# Altium project XL6012_power.PrjPcb
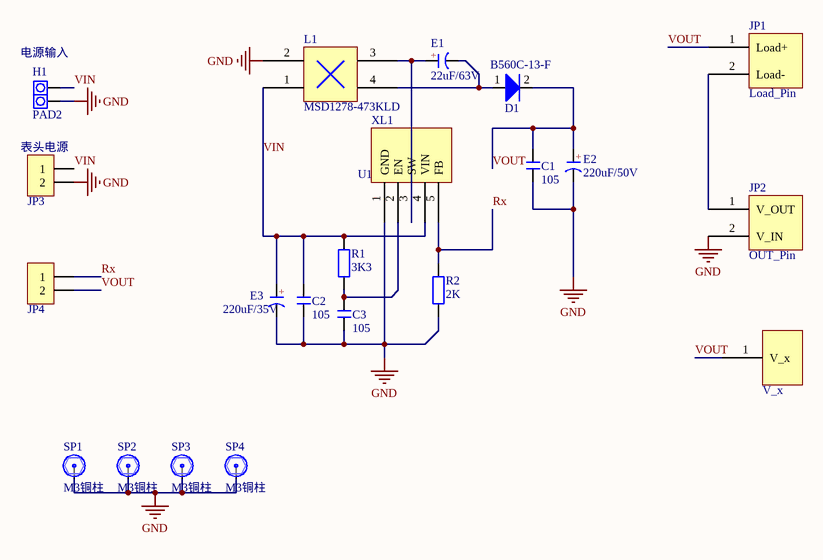
[diagram p0: BUCK-BOOST.SchDoc]
2 sheets, 41 parts. Net scope: global (net labels, ports and power ports of the same name join across sheets).
Board files: BUCK-BOOST.PcbDoc, Boost.PcbDoc
Sheets:
  BUCK-BOOST.SchDoc
  Boost.SchDoc

## Sheet BUCK-BOOST.SchDoc
size A4; SheetNumber: 1; SheetTotal: 1

### Parts
(Parts that share a designator on the sheet are numbered #1, #2 ... from top to bottom, then left to right.)
*1  V_x  [PCBComponent_1 - duplicate]
C1#1  105  [C 0603_L]
C2  105  [C 0603_L]
C3#1  105  [C 0603_L]
D1#1  B560C-13-F  [DO-214AB]
E1#1  22uF/63V  [CAP 2.5*6.3*11.2]
E2#1  220uF/50V  [CAPAER_D100_L130_P055]
E3  220uF/35V  [CAPAER_D080_L125_P035]
H1  PAD2  [PAD2-5.08]
JP1#1  Load_Pin  [connect]
JP2#1  OUT_Pin  [connect]
JP3#1  HDR-1X2  [HDR2.54-LI-2P]  (value not drawn)
JP4#1  HDR-1X2  [HDR2.54-LI-2P]  (value not drawn)
L1#1  MSD1278-473KLD  [MSD-1278]
R1#1  3K3  [R 0603_L]
R2  2K  [R 0603_L]
SP1#1  M3铜柱  [M3x4+6_L]
SP2#1  M3铜柱  [M3x4+6_L]
SP3#1  M3铜柱  [M3x4+6_L]
SP4#1  M3铜柱  [M3x4+6_L]
XL1  U1  [T220-5]

### Nets
GND: C1#1.2 C2.2 C3#1.2 E2#1.2(K) E3.2(K) H1.1 JP2#1.2(V_IN) JP3#1.2 L1#1.2 R2.1 SP1#1.1 SP2#1.1 SP3#1.1 SP4#1.1 XL1.1(GND)
Rx: JP4#1.1 R2.2 XL1.5(FB)
VIN: C2.1 E3.1(A) H1.2 JP3#1.1 L1#1.1 R1#1.2 XL1.4(VIN)
VOUT: *1.1(V_x) C1#1.1 D1#1.2(K) E2#1.1(A) JP1#1.1(Load+) JP4#1.2
NetC3#1_1: C3#1.1 R1#1.1 XL1.2(EN)
NetD1#1_1: D1#1.1(A) E1#1.2(K) L1#1.4
NetE1#1_1: E1#1.1(A) L1#1.3 XL1.3(SW)
NetJP1#1_2: JP1#1.2(Load-) JP2#1.1(V_OUT)

### Notes on the sheet
- (near H1) 电源输入
- (near JP3#1) 表头电源
- (in symbol C-CAP) +

### Library data of the parts
C1#1 C2 C3#1 = C: 无极性贴片电容; 版权归属: 源创客; BOM名称: 无极性贴片电容; 学习资源: www.ooocke.com
E1#1 E2#1 E3 = C-CAP: 直插电解电容; 版权归属: 源创客; BOM名称: 直插电解电容; 学习资源: www.ooocke.com
H1 = PAD2: 引线焊盘; 版权归属: 源创客; BOM名称: 引线焊盘; 学习资源: www.ooocke.com
JP3#1 JP4#1 = Header 2: 2P接插件; 版权归属: 源创客; BOM名称: 2P接插件; 学习资源: www.ooocke.com
R1#1 R2 = R: 贴片电阻; 版权归属: 源创客; BOM名称: 贴片电阻; 学习资源: www.ooocke.com
SP1#1 SP2#1 SP3#1 SP4#1 = 铜柱加头小焊盘: 铜柱; 版权归属: 源创客; BOM名称: 铜柱; 学习资源: www.ooocke.com
XL1 = XL6012

## Sheet Boost.SchDoc
size A4; SheetNumber: 2; SheetTotal: 1
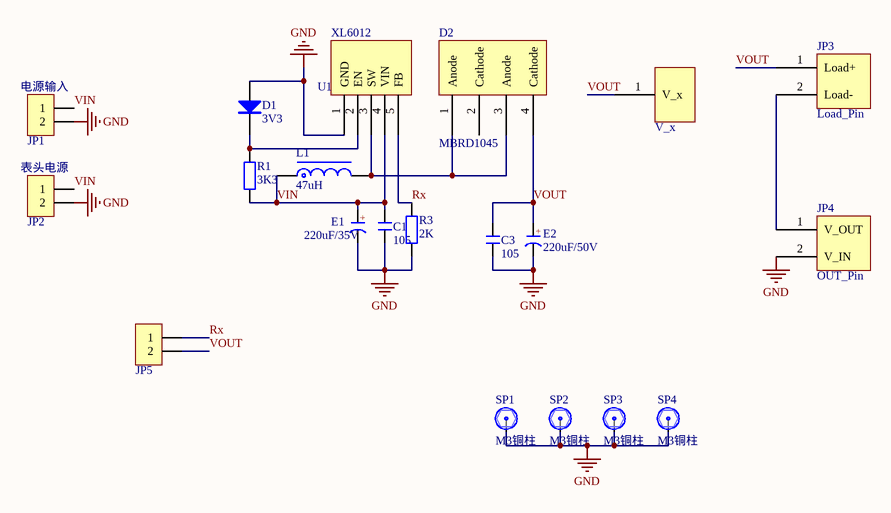
[diagram p1: Boost.SchDoc]

### Parts
(Parts that share a designator on the sheet are numbered #1, #2 ... from top to bottom, then left to right.)
*  V_x  [PCBComponent_1]
C1#2  105  [C 0603_L]
C3#2  105  [C 0603_L]
D1#2  3V3  [SOD-123]
D2  MBRD1045  [TO-252]
E1#2  220uF/35V  [CAPAER_D080_L125_P035]
E2#2  220uF/50V  [CAPAER_D100_L130_P055]
JP1#2  HDR-1X2  [HDR2.54-LI-2P]  (value not drawn)
JP2#2  HDR-1X2  [HDR2.54-LI-2P]  (value not drawn)
JP3#2  Load_Pin  [connect]
JP4#2  OUT_Pin  [connect]
JP5  HDR-1X2  [HDR2.54-LI-2P]  (value not drawn)
L1#2  47uH  [CD127]
R1#2  3K3  [R 0603_L]
R3  2K  [R 0603_L]
SP1#2  M3铜柱  [M3x4+6_L]
SP2#2  M3铜柱  [M3x4+6_L]
SP3#2  M3铜柱  [M3x4+6_L]
SP4#2  M3铜柱  [M3x4+6_L]
XL6012  U1  [T220-5]

### Nets
GND: C1#2.2 C3#2.2 D1#2.1(A) E1#2.2(K) E2#2.2(K) JP1#2.2 JP2#2.2 JP4#2.2(V_IN) R3.1 SP1#2.1 SP2#2.1 SP3#2.1 SP4#2.1 XL6012.1(GND)
Rx: JP5.1 R3.2 XL6012.5(FB)
VIN: C1#2.1 E1#2.1(A) JP1#2.1 JP2#2.1 L1#2.1 R1#2.2 XL6012.4(VIN)
VOUT: *.1(V_x) C3#2.1 D2.4(Cathode) E2#2.1(A) JP3#2.1(Load+) JP5.2
NetD1#2_2: D1#2.2(K) R1#2.1 XL6012.2(EN)
NetD2_1: D2.1(Anode) D2.3(Anode) L1#2.2 XL6012.3(SW)
NetJP3#2_2: JP3#2.2(Load-) JP4#2.1(V_OUT)

Not connected (* = marked no-connect by the designer): D2 2(Cathode)

### Notes on the sheet
- (near JP1#2) 电源输入
- (near JP2#2) 表头电源
- (in symbol C-CAP) +

### Library data of the parts
C1#2 C3#2 = C: 无极性贴片电容; 版权归属: 源创客; BOM名称: 无极性贴片电容; 学习资源: www.ooocke.com
D1#2 = 1N4007: 整流二极管; 版权归属: 源创客; BOM名称: 整流二极管; 学习资源: www.ooocke.com
E1#2 E2#2 = C-CAP: 直插电解电容; 版权归属: 源创客; BOM名称: 直插电解电容; 学习资源: www.ooocke.com
JP1#2 JP2#2 JP5 = Header 2: 2P接插件; 版权归属: 源创客; BOM名称: 2P接插件; 学习资源: www.ooocke.com
L1#2 = L-CD: 贴片功率电感; BOM名称: 功率电感; 版权归属: 源创客; 学习资源: www.ooocke.com
R1#2 R3 = R: 贴片电阻; 版权归属: 源创客; BOM名称: 贴片电阻; 学习资源: www.ooocke.com
SP1#2 SP2#2 SP3#2 SP4#2 = 铜柱加头小焊盘: 铜柱; 版权归属: 源创客; BOM名称: 铜柱; 学习资源: www.ooocke.com
XL6012 = XL6012

## Nets that join several sheets
GND: BUCK-BOOST (15 pins), Boost (14 pins)
Rx: BUCK-BOOST (JP4#1.1 R2.2 XL1.5), Boost (JP5.1 R3.2 XL6012.5)
VIN: BUCK-BOOST (7 pins), Boost (7 pins)
VOUT: BUCK-BOOST (6 pins), Boost (6 pins)